# EAGLE design PCB 2.2.1 (EAGLE 6.5.0)
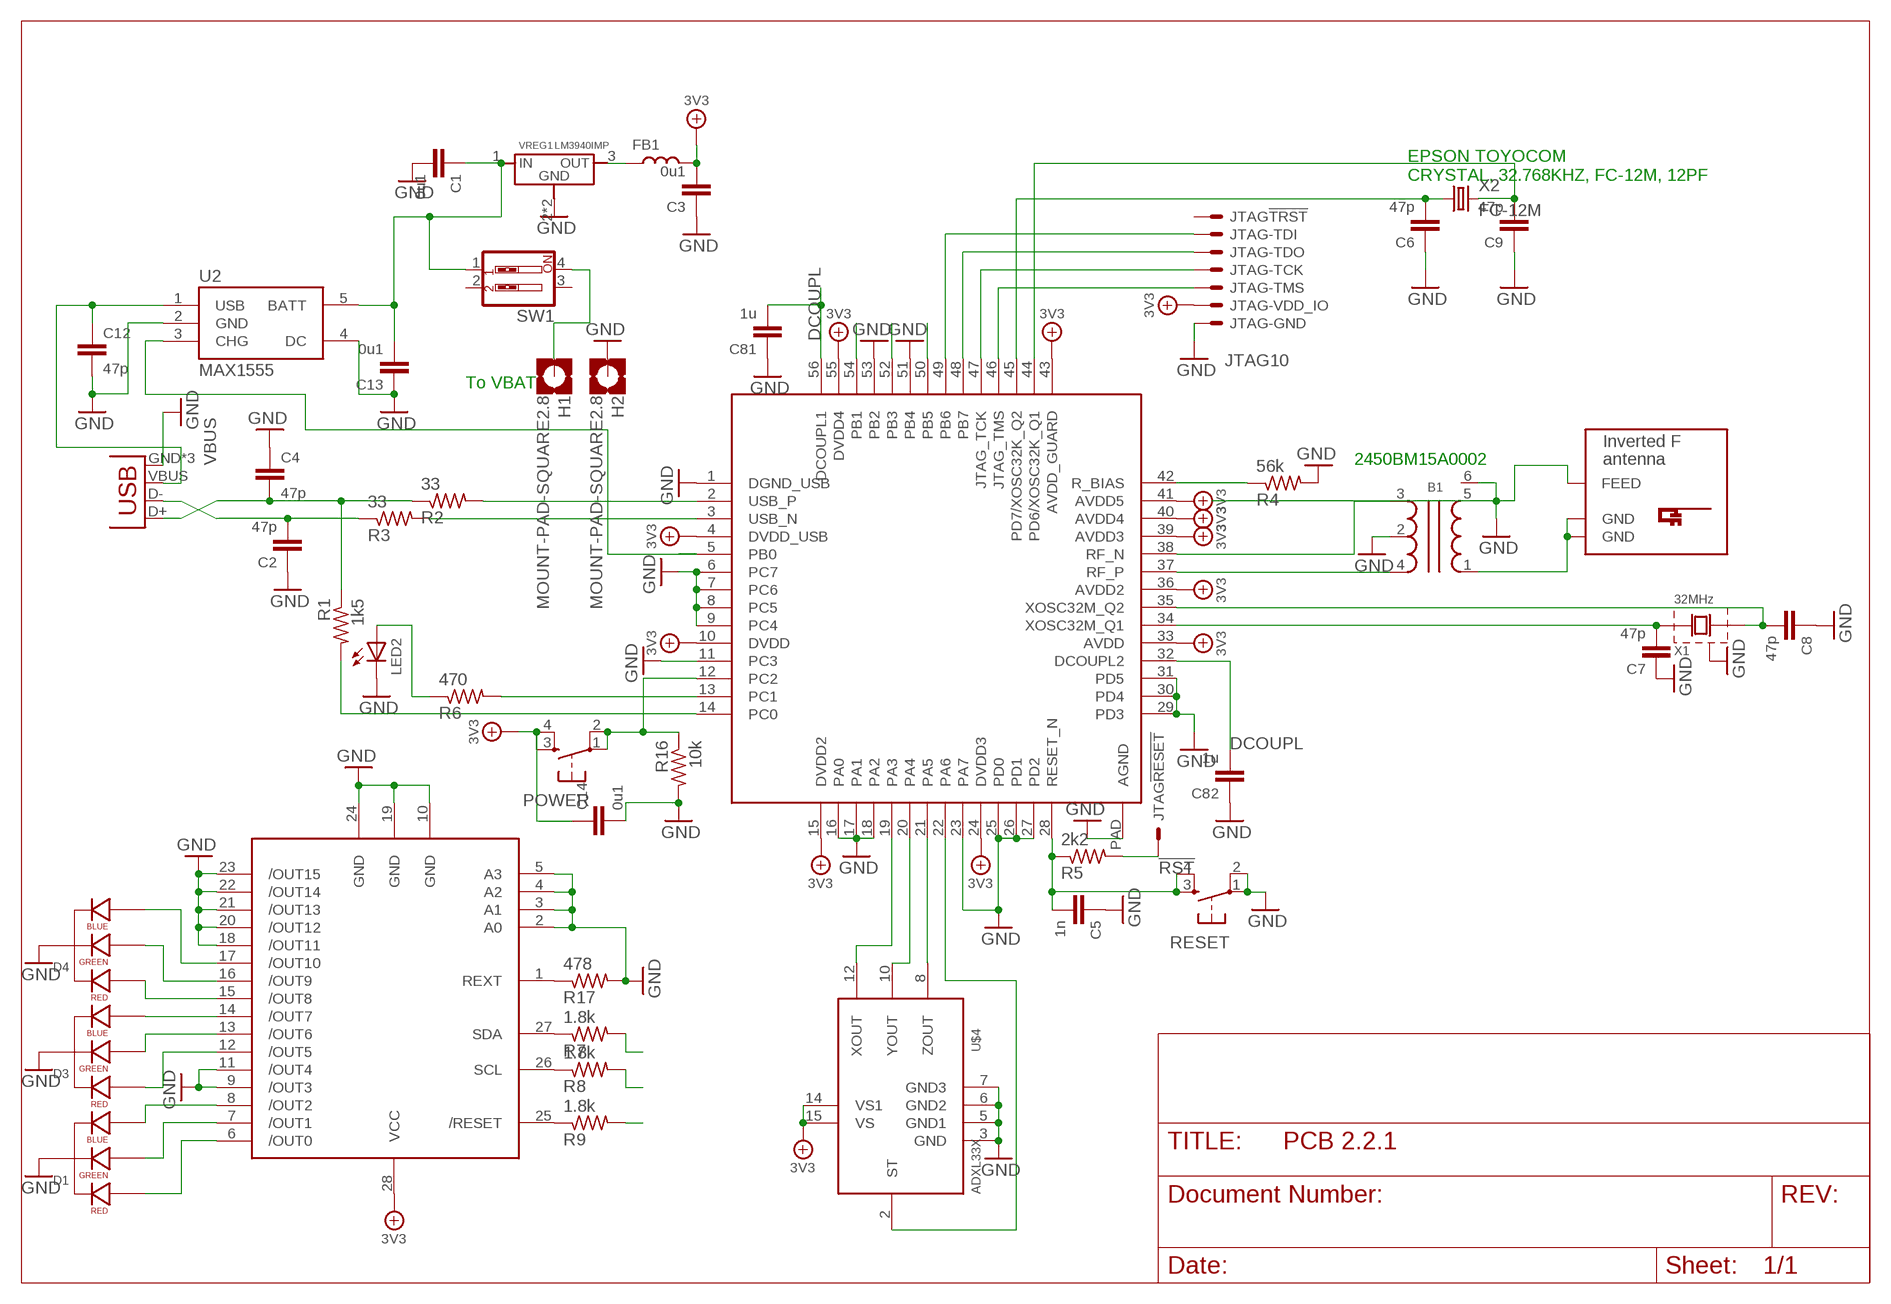
[diagram p0: schematic, sheet 1]

## Parts
B1  BALUN  [BALUN-0805]
C1  0u1  CC0402  [C0402]
C2  47p  CC0603  [C0603]
C3  0u1  CC0402  [C0402]
C4  47p  CC0603  [C0603]
C5  1n  CC0402  [C0402]
C6  47p  CC0603  [C0603]
C7  47p  CC0603  [C0603]
C8  47p  CC0603  [C0603]
C9  47p  CC0603  [C0603]
C12  47p  CC0603  [C0603]
C13  0u1  CC0402  [C0402]
C14  0u1  CC0402  [C0402]
C81  1u  CC0402  [C0402]
C82  1u  CC0402  [C0402]
D1  LED-RGB-CC-THRUCLEAR  [LED-RGB-THRU]
D3  LED-RGB-CC-THRUCLEAR  [LED-RGB-THRU]
D4  LED-RGB-CC-THRUCLEAR  [LED-RGB-THRU]
FB1  L0603  [R603]
H1  MOUNT-PAD-SQUARE2.8  [2,8-PAD-SQUARE]
H2  MOUNT-PAD-SQUARE2.8  [2,8-PAD-SQUARE]
JP1  USB-MICROB  [USB-MICROB]
JTAG  JTAG10  [HDR-2X5-2.00]
LED2  LED805  [LED-805]
POWER  TAC_SWITCHSMD  [TACTILE_SWITCH_SMD]
R1  1k5  R-US_R0402  [R0402]
R2  33  R-US_R0402  [R0402]
R3  33  R-US_R0402  [R0402]
R4  56k  R-US_R0402  [R0402]
R5  2k2  R-US_R0402  [R0402]
R6  470  R-US_R0402  [R0402]
R7  1.8k  R-US_R0402  [R0402]
R8  1.8k  R-US_R0402  [R0402]
R9  1.8k  R-US_R0402  [R0402]
R16  10k  R-US_R0402  [R0402]
R17  478  R-US_R0402  [R0402]
RESET  TAC_SWITCHSMD  [TACTILE_SWITCH_SMD]
SW1  SW_DIP-2  [DIPSWITCH-02]
U1  CC2538  [QFN56]
U2  MAX1555  [SOT23-5]
U$2  INVERTED_F_ANTENNA+0  [DN007+0]
U$3  TLC59116  [TSSOP28]
U$4  ADXL33X  [16LCSP]
VREG1  LM3940IMP  [SOT223]
X1  32MHz  XTAL-43225  [XTAL-4-3225]
X2  FC-12M  [FC-12M]

## Nets
3V3: C3.2 C14.1 FB1.2 JTAG.1 JTAG.2 POWER.3 POWER.4 U1.4(DVDD_USB) U1.10(DVDD) U1.15(DVDD2) U1.24(DVDD3) U1.33(AVDD) U1.36(AVDD2) U1.39(AVDD3) U1.40(AVDD4) U1.41(AVDD5) U1.43(AVDD_GUARD) U1.55(DVDD4) U$3.28(VCC) U$4.14(VS1) U$4.15(VS)
!RST: JTAG.4 R5.2
!RST_PIN: C5.2 R5.1 RESET.3 RESET.4 U1.28(RESET_N)
ACCRESET: R9.2 U1.54(PB1)
ACCSCL: R8.2 U1.52(PB3)
ACCSDA: R7.2 U1.50(PB5)
CN1: C4.2 JP1.D+ R1.1 R2.1
DCOUPL: C81.2 C82.2 U1.32(DCOUPL2) U1.56(DCOUPL1)
GND: B1.2 B1.5 B1.6 C1.2 C2.1 C3.1 C4.1 C5.1 C6.1 C7.1 C8.1 C9.1 C12.2 C13.1 C14.2 C81.1 C82.1 D1.2(CATHODE) D3.2(CATHODE) D4.2(CATHODE) H2.B2,8(MOUNT) JP1.GND JP1.MT1(GND) JP1.MT2(GND) JTAG.8 JTAG.10 LED2.C R4.2 R16.2 R17.2 RESET.1 RESET.2 U1.1(DGND_USB) U1.6(PC7) U1.7(PC6) U1.8(PC5) U1.9(PC4) U1.11(PC3) U1.16(PA0) U1.18(PA2) U1.23(PA7) U1.25(PD0) U1.26(PD1) U1.27(PD2) U1.29(PD3) U1.30(PD4) U1.31(PD5) U1.51(PB4) U1.53(PB2) U1.PAD(AGND) U2.2(GND) U2.4(DC) U$2.FEED U$3.2(A0) U$3.3(A1) U$3.4(A2) U$3.5(A3) U$3.9(/OUT3) U$3.10(GND) U$3.11(/OUT4) U$3.18(/OUT11) U$3.19(GND) U$3.20(/OUT12) U$3.21(/OUT13) U$3.22(/OUT14) U$3.23(/OUT15) U$3.24(GND) U$4.3(GND) U$4.5(GND1) U$4.6(GND2) U$4.7(GND3) VREG1.2(GND) VREG1.4(GND) X1.2(GND1) X1.4(GND1)
N$1: R2.2 U1.2(USB_P)
N$2: R3.2 U1.3(USB_N)
N$3: POWER.1 POWER.2 R16.1 U1.12(PC2)
N$4: R1.2 U1.14(PC0)
N$5: R4.1 U1.42(R_BIAS)
N$6: JTAG.9 U1.47(JTAG_TCK)
N$7: JTAG.7 U1.46(JTAG_TMS)
N$8: U1.21(PA5) U$4.8(ZOUT)
N$9: U1.20(PA4) U$4.10(YOUT)
N$10: U1.19(PA3) U$4.12(XOUT)
N$11: C1.1 C13.2 SW1.1 U2.5(BATT) VREG1.1(IN)
N$12: C2.2 JP1.D- R3.1
N$13: H1.B2,8(MOUNT) SW1.4
N$14: D1.1(RED_CATHODE) U$3.6(/OUT0)
N$15: D1.3(GREEN_CATHODE) U$3.7(/OUT1)
N$16: U1.22(PA6) U$4.2(ST)
N$17: FB1.1 VREG1.3(OUT)
N$18: D1.4(BLUE_CATHODE) U$3.8(/OUT2)
N$19: R17.1 U$3.1(REXT)
N$20: D4.1(RED_CATHODE) U$3.15(/OUT8)
N$21: U1.5(PB0) U2.3(CHG)
N$22: D4.3(GREEN_CATHODE) U$3.16(/OUT9)
N$23: C6.2 U1.45(PD7/XOSC32K_Q2) X2.1
N$24: D3.1(RED_CATHODE) U$3.12(/OUT5)
N$25: D4.4(BLUE_CATHODE) U$3.17(/OUT10)
N$26: D3.3(GREEN_CATHODE) U$3.13(/OUT6)
N$27: B1.3 U1.38(RF_N)
N$28: B1.4 U1.37(RF_P)
N$29: D3.4(BLUE_CATHODE) U$3.14(/OUT7)
N$30: C8.2 U1.35(XOSC32M_Q2) X1.3(X2)
N$31: C7.2 U1.34(XOSC32M_Q1) X1.1(X1)
N$40: C9.2 U1.44(PD6/XOSC32K_Q1) X2.2
N$42: LED2.A R6.1
N$43: R6.2 U1.13(PC1)
N$50: R7.1 U$3.27(SDA)
N$51: R8.1 U$3.26(SCL)
N$52: R9.1 U$3.25(/RESET)
PB6: JTAG.5 U1.49(PB6)
PB7: JTAG.6 U1.48(PB7)
RF: B1.1 U$2.GND U$2.GND@1(GND)
VBUS: C12.1 JP1.VBUS U2.1(USB)
Unconnected: JTAG.3 SW1.2 SW1.3 U1.17(PA1)

## Notes on the sheet
- EPSON TOYOCOM
  CRYSTAL, 32.768KHZ, FC-12M, 12PF
- To VBAT
- 2450BM15A0002

## Library data of the parts
B1 = discrete:BALUN
C1-C9 C12-C14 C81 C82 = discrete:C: CAPACITOR, European symbol
D1 D3 D4 = SparkFun-LED:LED-RGB-CC-THRU: RGB Through-hole common cathode LED SparkFun Storefront: COM-00105 (Clear) COM-09264 (Diffuse); PROD_ID: DIO-08418
FB1 = discrete:L
H1 H2 = holes:MOUNT-PAD-SQUARE: MOUNTING PAD, square
JP1 = SparkFun-Connectors:USB: USB Connectors USB-B-PTH is fully proven SKU : PRT-00139/CONN-08278 USB-miniB is fully proven SKU : PRT-00587 USB-A-PCB is untested. USB-A-H is throughly reviewed, but untested. Spark Fun Electronics SKU : PRT-00437 USB-B-SMT is throughly reviewed, but untested. Needs silkscreen touching up. USB-A-S has not been used/tested USB-MB-H has not been used/tested USB-MICROB has been used. CONN-09505; PROD_ID: CONN-09505
JTAG = jtag:JTAG10
LED2 = discrete:LED
POWER RESET = SparkFun-Electromechanical:TAC_SWITCH: Momentary Switch Button commonly used for reset or general input. Spark Fun Electronics SKU : COM-00097 SMT- SWCH-08247; PROD_ID: SWCH-08247
R1-R9 R16 R17 = rcl:R-US_: RESISTOR, American symbol
SW1 = SparkFun-Electromechanical:SW_DIP-2: DIP SWITCH
U1 = ic:CC2538
U2 = SparkFun-PowerIC:MAX1555: MAX1555 Lithium Charger IC SOT-23 Lithium Polymer charging IC. Schematic element and footprint proven. Spark Fun Electronics SKU : COM-00674
U$2 = antenna:INVERTED_F_ANTENNA: 2.4GHz Inverted F Antenna Based on TI Design Note DN007
U$3 = tlc59116:TLC59116
U$4 = adafruit:ADXL33X
VREG1 = voltage-regulators:LM3940
X1 = discrete:XTAL-4
X2 = crystal:FC-12M: kHz RANGE CRYSTAL UNIT LOW PROFILE SMD Source: Epson Toyocom FC-12M.pdf

## Net classes
0 default: width 0.152 mm, drill 0.305 mm, clearance 0.152 mm
1 RF: width 0.152 mm, clearance 0.152 mm

## Board
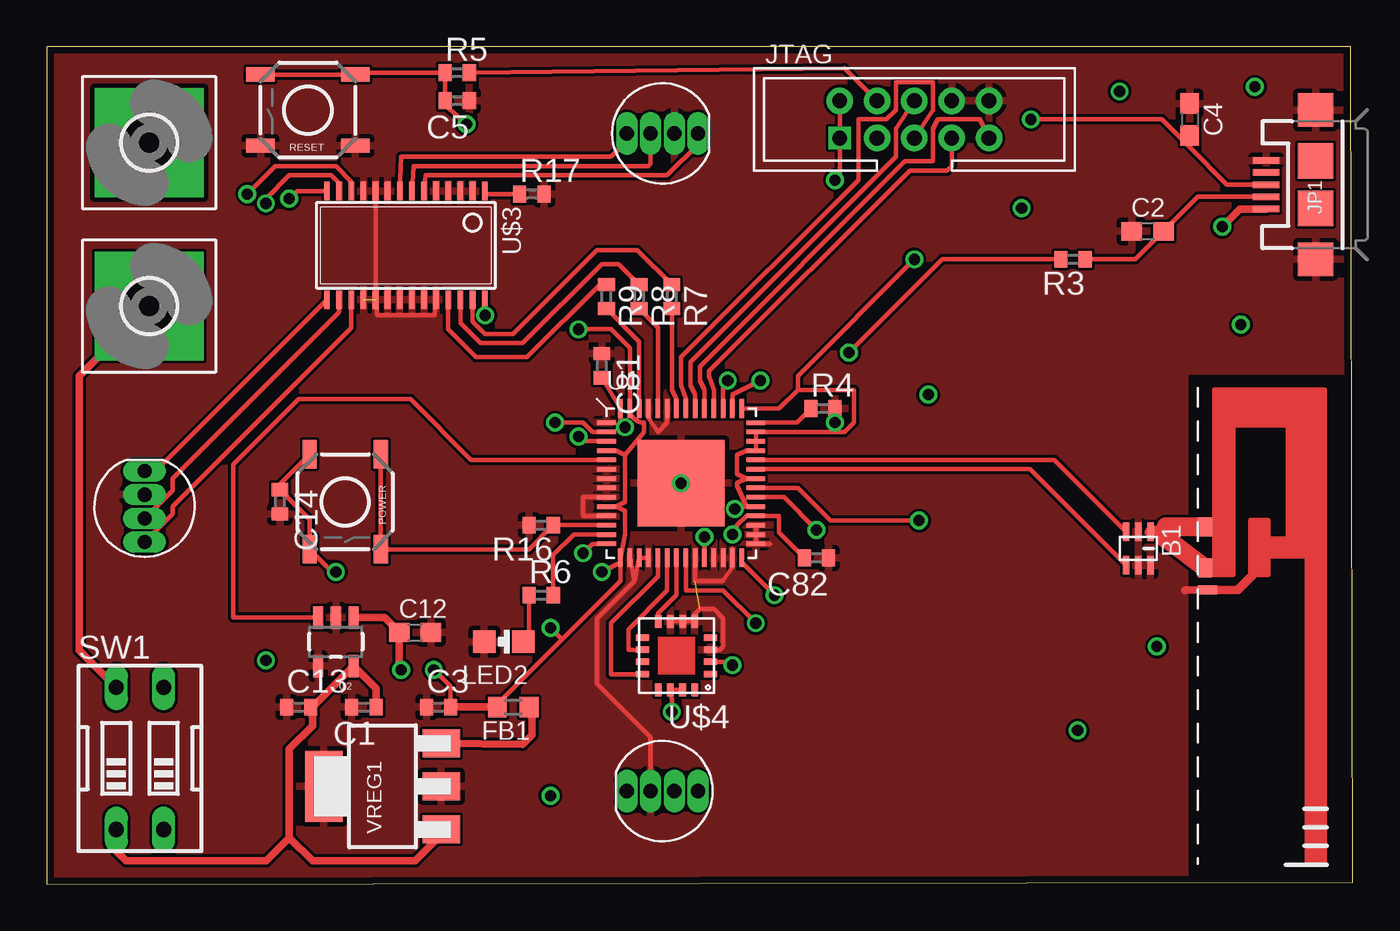
[diagram p1: board, top side]
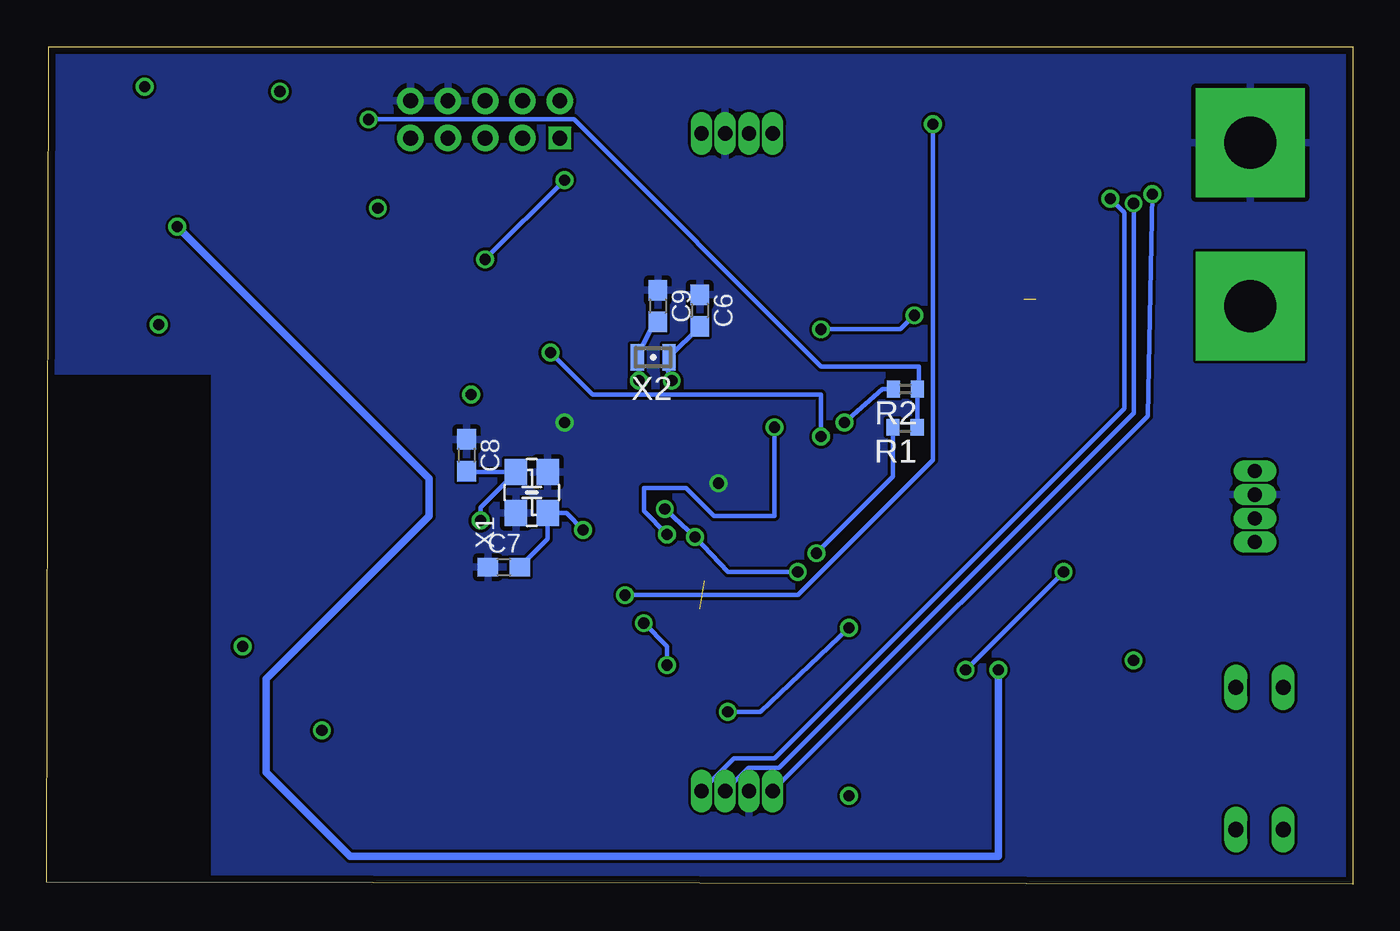
[diagram p2: board, bottom side, seen from below]

Size 70 x 44.9 mm. Coordinates in mm from the lower left corner, seen from the top.
Outline: 0,0 70,0.1 69.9,44.9 0,44.9 0,0
Copper layers (1*16): Top 0.0356mm / dielectric 1.5011mm / Bottom 0.0356mm
Design rules "LaenPCBOrder": minimum track width 6mil, minimum drill 13mil, track to track 6mil, track to pad 6mil, pad to pad 6mil, via to via 6mil, smd to smd 6mil, copper to edge 15mil, drill to drill 6mil, minimum pad ring 7mil, minimum via ring 7mil, stop-mask expansion 3mil, vias tented up to drill 0mil, thermal gap 10mil

### Footprints (pad centres in the part's own frame; a part is rotated, then mirrored left to right if it is on the bottom)
BALUN-0805 = smd 1 x 0.35: 1 -0.9,0.65; 2 -0.9,0; 3 -0.9,-0.65; 4 0.9,-0.65; 5 0.9,0; 6 0.9,0.65
C0402 = smd 0.7 x 0.9: 1 -0.65,0; 2 0.65,0
C0603 = smd 1.1 x 1: 1 -0.85,0; 2 0.85,0
LED-RGB-THRU = drill 0.762 pad 0.889 long: 1 1.905,0; 2 0.635,0; 3 -0.635,0; 4 -1.905,0
R603 = smd 1 x 1.1: 1 -0.85,0; 2 0.85,0
2,8-PAD-SQUARE = drill 2.8 pad 5.842 square: B2,8 0,0
USB-MICROB = smd 0.35 x 1.4: D+ 0,2.65; D- -0.65,2.65; GND 1.3,2.65; ID 0.65,2.65; VBUS -1.3,2.65 | smd 1.8 x 1.9: MT1 -4,0; MT2 4,0 | smd 1.9 x 1.9: P$1 -1.27,0; P$2 1.27,0
HDR-2X5-2.00 = drill 0.8 square: 1 -4,-1 | drill 0.8 pad 1.422: 2 -4,1; 3 -2,-1; 4 -2,1; 5 0,-1; 6 0,1; 7 2,-1; 8 2,1; 9 4,-1; 10 4,1
LED-805 = smd 1.2 x 1.2: A 0,-1.05; C 0,1.05
TACTILE_SWITCH_SMD = smd 1.524 x 0.762: 1 -2.54,1.905; 2 2.54,1.905; 3 -2.54,-1.905; 4 2.54,-1.905
R0402 = smd 0.7 x 0.9: 1 -0.65,0; 2 0.65,0
DIPSWITCH-02 = drill 0.813 long: 1 -1.27,-3.81; 2 1.27,-3.81; 3 1.27,3.81; 4 -1.27,3.81
QFN56 = smd 1 x 0.24: 1 -4,3.25; 2 -4,2.75; 3 -4,2.25; 4 -4,1.75; 5 -4,1.25; 6 -4,0.75; 7 -4,0.25; 8 -4,-0.25; 9 -4,-0.75; 10 -4,-1.25; 11 -4,-1.75; 12 -4,-2.25; 13 -4,-2.75; 14 -4,-3.25; 29 4,-3.25; 30 4,-2.75; 31 4,-2.25; 32 4,-1.75; 33 4,-1.25; 34 4,-0.75; 35 4,-0.25; 36 4,0.25; 37 4,0.75; 38 4,1.25; 39 4,1.75; 40 4,2.25; 41 4,2.75; 42 4,3.25 | smd 0.24 x 1: 15 -3.25,-4; 16 -2.75,-4; 17 -2.25,-4; 18 -1.75,-4; 19 -1.25,-4; 20 -0.75,-4; 21 -0.25,-4; 22 0.25,-4; 23 0.75,-4; 24 1.25,-4; 25 1.75,-4; 26 2.25,-4; 27 2.75,-4; 28 3.25,-4; 43 3.25,4; 44 2.75,4; 45 2.25,4; 46 1.75,4; 47 1.25,4; 48 0.75,4; 49 0.25,4; 50 -0.25,4; 51 -0.75,4; 52 -1.25,4; 53 -1.75,4; 54 -2.25,4; 55 -2.75,4; 56 -3.25,4 | smd 4.65 x 4.65: PAD 0,0
SOT23-5 = smd 0.55 x 1.2: 1 -0.95,-1.3; 2 0,-1.3; 3 0.95,-1.3; 4 0.95,1.3; 5 -0.95,1.3
DN007+0 = smd 0.46 x 1: FEED 2.22,-2.8 | smd 1.01 x 0.74: GND -1.16,-2.93; GND@1 1.035,-2.93
TSSOP28 = smd 0.305 x 0.991: 1 -4.225,-2.918; 2 -3.575,-2.918; 3 -2.925,-2.918; 4 -2.275,-2.918; 5 -1.625,-2.918; 6 -0.975,-2.918; 7 -0.325,-2.918; 8 0.325,-2.918; 9 0.975,-2.918; 10 1.625,-2.918; 11 2.275,-2.918; 12 2.925,-2.918; 13 3.575,-2.918; 14 4.225,-2.918; 15 4.225,2.918; 16 3.575,2.918; 17 2.925,2.918; 18 2.275,2.918; 19 1.625,2.918; 20 0.975,2.918; 21 0.325,2.918; 22 -0.325,2.918; 23 -0.975,2.918; 24 -1.625,2.918; 25 -2.275,2.918; 26 -2.925,2.918; 27 -3.575,2.918; 28 -4.225,2.918
16LCSP = smd 0.7 x 0.35: 1 -1.825,0.975; 2 -1.825,0.325; 3 -1.825,-0.325; 4 -1.825,-0.975; 9 1.825,-0.975; 10 1.825,-0.325; 11 1.825,0.325; 12 1.825,0.975 | smd 0.35 x 0.7: 5 -0.975,-1.85; 6 -0.35,-1.85; 7 0.325,-1.85; 8 0.975,-1.85; 13 0.975,1.825; 14 0.325,1.825; 15 -0.325,1.825; 16 -0.975,1.825
SOT223 = smd 1.5 x 2: 1 -2.3,-3.15; 2 0,-3.15; 3 2.3,-3.15 | smd 3.8 x 2: 4 0,3.15
XTAL-4-3225 = smd 1.4 x 1.2: 1 -1.1,-0.85; 2 1.1,-0.85; 3 1.1,0.85; 4 -1.1,0.85
FC-12M = smd 0.7 x 1.4: 1 -0.85,0; 2 0.85,0

### Placement (x,y rotation side)
B1  58.5,18 270 top
C1  17,9.5 180 top
C2  59,35 0 top
C3  21,9.5 0 top
C4  61.25,41 270 top
C5  22,42 180 top
C6  35,30.75 270 bottom
C7  45.5,17 0 bottom
C8  47.5,23 270 bottom
C9  37.25,31 270 bottom
C12  19.75,13.5 0 top
C13  13.5,9.5 0 top
C14  12.5,20.5 270 top
C81  29.75,27.8 270 top
C82  41.25,17.5 180 top
D1  33,40.25 0 top
D3  33,5 180 top
D4  5.25,20.25 90 top
FB1  25,9.5 180 top
H1  5.5,31 0 top
H2  5.5,39.75 0 top
JP1  68,37.5 90 top
JTAG  46.5,41 0 top
LED2  24.5,13 90 top
POWER  16,20.5 270 top
R1  24,24.5 180 bottom
R2  23.98,26.55 180 bottom
R3  55,33.5 180 top
R4  41.6,25.5 0 top
R5  22,43.5 0 top
R6  26.5,15.5 0 top
R7  33.5,31.5 270 top
R8  31.75,31.5 270 top
R9  30,31.5 270 top
R16  26.5,19.25 180 top
R17  26,37 0 top
RESET  14,41.5 180 top
SW1  5,6.75 0 top
U1  34,21.5 0 top
U2  15.5,13 180 top
U$2  65,18 270 top
U$3  19.25,34.25 180 top
U$4  33.75,12.25 180 top
VREG1  18,5.25 90 top
X1  44,21 90 bottom
X2  37.5,28.25 180 bottom

### Tracks (layer width: path | path; a pad name or v marks a point on that pad's centre or on a via)
3V3  (via drill 0.6)
  Top 0.254: FB1.2 24.15,9.65 27.62,13.12 | 27.62,13.12 30.75,16.25 U1.15 | JTAG.2 JTAG.1 42.5,38 v42.25,37.75 | 38,25.5 U1.43 39.25,25.5 40.25,26.5 | 40.25,26.5 43.25,26.5 43.25,24.75 42.75,24.25 U1.41 U1.40 U1.39 37.5,23.25 37,23 37,22 37.5,21.75 | U$4.15 U$4.14 33.5,9.85 v33.5,9.25 | v46.5,33.5 40.25,27.25 40.25,26.5 | POWER.3 12.5,21.45 C14.1 14.1,19.55 POWER.4 15.3,16.75 v15.5,16.75 | v28.5,29.75 30.25,29.75 31.25,28.75 U1.55 arc90 32,24.75 32,24.25 31,23 | v23.5,30.5 23.5,31.31 U$3.28 | U1.36 37.5,21.75 | 37.5,21.75 37,21.5 37,21.38 37.5,20.25 | 37.5,20.25 U1.33 | 37.5,20.25 v36.88,20.12 | v35.25,18.62 U1.24 | 30.5,20.25 31,20 31,18.75 U1.15 | U1.10 30.5,20.25 | 30.5,20.25 31,20.5 31,23 | 31,23 30.5,23.25 U1.4 | C3.2 21.65,10.6 v20.75,11.5 | U1.15 30.75,17.25 v29.75,16.75 | v27,13.75 27.62,13.12
  Top 0.406: FB1.2 C3.2
  Bottom 0.254: v42.25,37.75 v46.5,33.5 | v28.5,29.75 24.25,29.75 v23.5,30.5 | v36.88,20.12 36.75,20 v35.25,18.62 33.5,16.75 v29.75,16.75 | v20.75,11.5 v15.5,16.75 | v33.5,9.25 31.75,9.25 v27,13.75
!RST
  Top 0.254: JTAG.4 42.75,43.75 R5.2
!RST_PIN  (via drill 0.6)
  Top 0.254: 16.39,43.5 RESET.3 | RESET.3 RESET.4 | v22.5,40.75 21.35,41.75 C5.2 R5.1 16.64,43.5 RESET.3 | v39,15.5 37.25,17.25 U1.28
  Bottom 0.254: v22.5,40.75 22.5,22.75 29.75,15.5 v39,15.5
ACCRESET
  Top 0.254: U1.54 31.75,29.1 R9.2
ACCSCL
  Top 0.254: U1.52 32.75,29.85 R8.2
ACCSDA
  Top 0.254: U1.50 33.75,26 33.5,26.5 R7.2
CN1  (via drill 0.6)
  Top 0.254: JP1.D+ 63.25,37.5 61.25,39.5 | 61.25,39.5 C4.2 | 61.25,39.5 59.75,41 v52.75,41
  Bottom 0.254: v52.75,41 41.75,41 28.5,27.75 23.25,27.75 23.25,26.55 R2.1 23.33,24.5 R1.1
DCOUPL  (via drill 0.6)
  Top 0.254: C81.2 U1.56 30.75,24.75 v31,24.5 | C82.2 39.25,18.85 39.25,19.75 U1.32 37.5,19.75 37,19.25 v36.75,18.75
  Bottom 0.254: v31,24.5 31,19.75 34.25,19.75 35.75,21.25 38,21.25 38,20 v36.75,18.75
GND  (via drill 0.6)  (2 unrouted)
  Top 0.254: R4.2 v42.25,24.75 | U1.31 U1.29 38.75,18.25 | U1.23 34.75,16.25 36.25,16.25 36.75,17 U1.27 36.75,18 | U1.53 32.25,25 32.75,24.25 33.25,24.75 U1.51 | U1.9 28.75,20.75 28.75,19.75 U1.11 | U1.16 31.5,16.25 | 31.5,16.25 29.5,14.25 29.5,10.75 32.37,7.88 D3.2 | 31.5,16.25 31.75,17.5 U1.18 | U$3.24 20.79,30.5 17.71,30.5 U$3.19 U$3.10 | U$4.7 U$4.6 U$4.5 34.73,14.47 35,14.75 35.75,14.75 36.25,14.25 36.25,12.75 36.08,12.57 U$4.3
  Top 0.406: U$2.FEED 61.03,15.78 61,15.75
  Bottom 0.254: v42.25,24.75 42,24.75
  other vias: 34,21.5
  pour Top: -0.5,45.5 70.5,45.5 70.5,27.5 61,27.5 61,-1 -0.5,-1
  pour Bottom: -0.5,45 70,45 70,27.5 61,27.5 61,-0.5 -0.5,-0.5
N$1  (via drill 0.6)
  Top 0.254: v27.25,24.75 28.75,24.75 29.25,24.25 U1.2
  Bottom 0.254: R2.2 25.2,26.55 v27.25,24.75
N$2  (via drill 0.6)
  Top 0.254: R3.2 48,33.5 v43,28.5 | v28.5,24 28.75,23.75 U1.3
  Bottom 0.254: v43,28.5 40.75,26.25 28.5,26.25 v28.5,24
N$3
  Top 0.254: POWER.1 POWER.2 25.86,17.96 R16.1 U1.12
N$4  (via drill 0.6)
  Top 0.254: v28.75,17.75 29.25,18.25 U1.14
  Bottom 0.254: R1.2 24.65,21.85 v28.75,17.75
N$5
  Top 0.254: R4.1 40.2,24.75 U1.42
N$6
  Top 0.254: JTAG.9 50,41 47.75,41 47.5,40.5 47.5,38.75 46,38.75 35,27.75 35,27 35.25,26.5 U1.47
N$7
  Top 0.254: U1.46 35.75,26.5 35.5,27.25 35.5,27.5 46.25,38.25 48.25,38.25 48.5,38.5 JTAG.7
N$8
  Top 0.254: U$4.8 32.77,14.53 33.75,15.5 U1.21
N$9
  Top 0.254: U$4.10 31.18,12.57 31.18,13.68 33.25,15.75 U1.20
N$10
  Top 0.254: U$4.12 31.9,11.25 30.25,11.25 30.25,14 32.75,16.5 U1.19
N$11
  Top 0.406: C1.1 17.65,10.5 U2.5 14.25,9.5 14.25,8.9 | VREG1.1 21.15,2.65 19.75,1.25 14.25,1.25 13,2.5 | 13,2.5 13,7.25 14.25,8.5 14.25,8.9 | 14.25,8.9 C13.2 | SW1.1 3.73,1.77 4.25,1.25 11.75,1.25 13,2.5
N$12
  Top 0.254: JP1.D- 61.7,36.85 C2.2 58.35,33.5 R3.1
N$13
  Top 0.406: H1.B2,8 1.75,27.25 1.75,12.54 SW1.4
N$14
  Top 0.254: U$3.6 20.31,38 33.25,38 34.91,39.66 D1.1
N$15
  Top 0.254: U$3.7 19.66,38.5 32.25,38.5 32.37,38.62 D1.3
N$16  (via drill 0.6)
  Top 0.254: U1.22 34.25,15.75 36.25,15.75 v38,14 | U$4.2 36.58,11.93 v36.75,11.75
  Bottom 0.254: v36.75,11.75 36.75,12.75 v38,14
N$17
  Top 0.406: VREG1.3 25.5,7.5 26,8 26,8.85 FB1.1
N$18
  Top 0.254: U$3.8 19.01,39 30.25,39 31.09,39.84 D1.4
N$19
  Top 0.254: U$3.1 23.64,37 R17.1
N$20
  Top 0.254: U$3.15 5.85,22.16 D4.1
N$21
  Top 0.254: U2.3 10,14.3 10,22.5 13.5,26 19.5,26 22.75,22.75 U1.5
N$22
  Top 0.254: U$3.16 15.68,30.68 6.75,21.75 6.75,21.11 D4.3
N$23  (via drill 0.6)
  Top 0.254: v36.5,27 36.25,27 U1.45
  Bottom 0.254: v36.5,27 36.75,27.65 X2.1 C6.2
N$24  (via drill 0.6)
  Top 0.254: v10.75,37 12.25,38.5 15.5,38.5 16.32,37.67 U$3.12
  Bottom 0.254: D3.1 11,25.09 v10.75,37
N$25
  Top 0.254: U$3.17 16.32,29.82 6.75,20.25 6.75,19.84 D4.4
N$26  (via drill 0.6)
  Top 0.254: v11.75,36.5 11.75,36.75 13,38 15.25,38 15.68,37.58 U$3.13
  Bottom 0.254: D3.3 32.38,6.25 30.75,6.25 11.75,25.25 v11.75,36.5
N$27
  Top 0.254: B1.3 54,22.75 U1.38
N$28
  Top 0.254: B1.4 52.7,22.25 U1.37
N$29  (via drill 0.6)
  Top 0.254: v13,36.75 13.42,37.17 U$3.14
  Bottom 0.254: D3.4 33.16,6.75 31,6.75 12.25,25.5 12.25,36 v13,36.75
N$30  (via drill 0.6)
  Top 0.254: v46.75,19.5 42,19.5 40.25,21.25 U1.35
  Bottom 0.254: C8.2 47.45,22.1 X1.3 46.75,20.2 v46.75,19.5
N$31  (via drill 0.6)
  Top 0.254: v41.25,19 39.5,20.75 U1.34
  Bottom 0.254: C7.2 43.15,18.5 X1.1 42.15,19.9 v41.25,19
N$35  (via drill 0.6)
  other vias: 64,30
N$36  (via drill 0.6)
  other vias: 59.5,12.75
N$37  (via drill 0.6)
  other vias: 55.25,8.25
N$38  (via drill 0.6)
  other vias: 27,4.75
N$39  (via drill 0.6)
  other vias: 47.25,26.25
N$40  (via drill 0.6)
  Top 0.254: U1.44 36.75,26.25 v38.25,27
  Bottom 0.254: v38.25,27 38.25,27.65 X2.2 37.6,29.8 C9.2
N$41  (via drill 0.6)
  other vias: 52.25,36.25
N$42
  Top 0.254: LED2.A 25.85,13.3 R6.1
N$43
  Top 0.254: R6.2 27.15,17.65 28.25,18.75 U1.13
N$44  (via drill 0.6)
  other vias: 57.5,42.5
N$45  (via drill 0.6)
  other vias: 64.75,42.75
N$46  (via drill 0.6)
  other vias: 11.75,12
N$50
  Top 0.254: U$3.27 22.82,30.18 23.5,29.5 25,29.5 29.5,34 31.65,34 R7.1
N$51
  Top 0.254: U$3.26 22.18,30.07 23.25,29 25.5,29 29.75,33.25 30.65,33.25 R8.1
N$52
  Top 0.254: R9.1 29.65,32.15 25.75,28.25 23,28.25 21.5,29.75 21.5,31.31 U$3.25
PB6
  Top 0.254: U1.49 34.25,26 34,26.75 34,28.25 43.5,37.75 43.5,41 45,41 45.5,41.5 45.5,43 47.5,43 47.5,41.5 JTAG.5
PB7
  Top 0.254: U1.48 34.75,26.25 34.5,26.75 34.5,28 45.5,39 45.5,40.5 JTAG.6
RF
  Top 0.61: 60,19 B1.1
  Top 0.813: 60,18.5 60,19
  Top 1.016: U$2.GND 60,19.16 60,19 | U$2.GND@1 60,18.5
VBUS  (via drill 0.6)
  Top 0.406: U2.1 18.1,14.3 C12.1 18.9,11.6 v19,11.5 | v63,35.25 63.95,36.2 JP1.VBUS
  Bottom 0.406: v19,11.5 19,1.5 53.75,1.5 58.25,6 58.25,11 49.5,19.75 49.5,21.75 v63,35.25